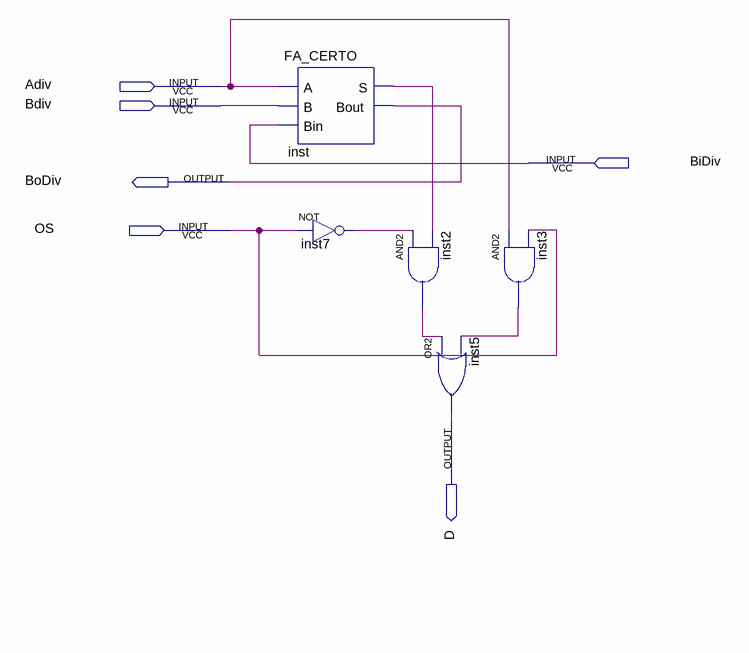
[diagram p0: schematic sheet]
// Quartus schematic Divisor.bdf as structural Verilog: 5 symbols, 6 pins
module Divisor (
  input  Adiv,
  input  Bdiv,
  input  BiDiv,
  input  OS,
  output BoDiv,
  output D
);

  wire inst2_out, inst3_out, inst7_out, inst_s;

  FA_CERTO inst (.A(Adiv), .B(Bdiv), .Bin(BiDiv), .S(inst_s), .Bout(BoDiv));
  not inst7 (inst7_out, OS);
  and inst2 (inst2_out, inst7_out, inst_s);
  or inst5 (D, inst2_out, inst3_out);
  and inst3 (inst3_out, Adiv, OS);
endmodule
